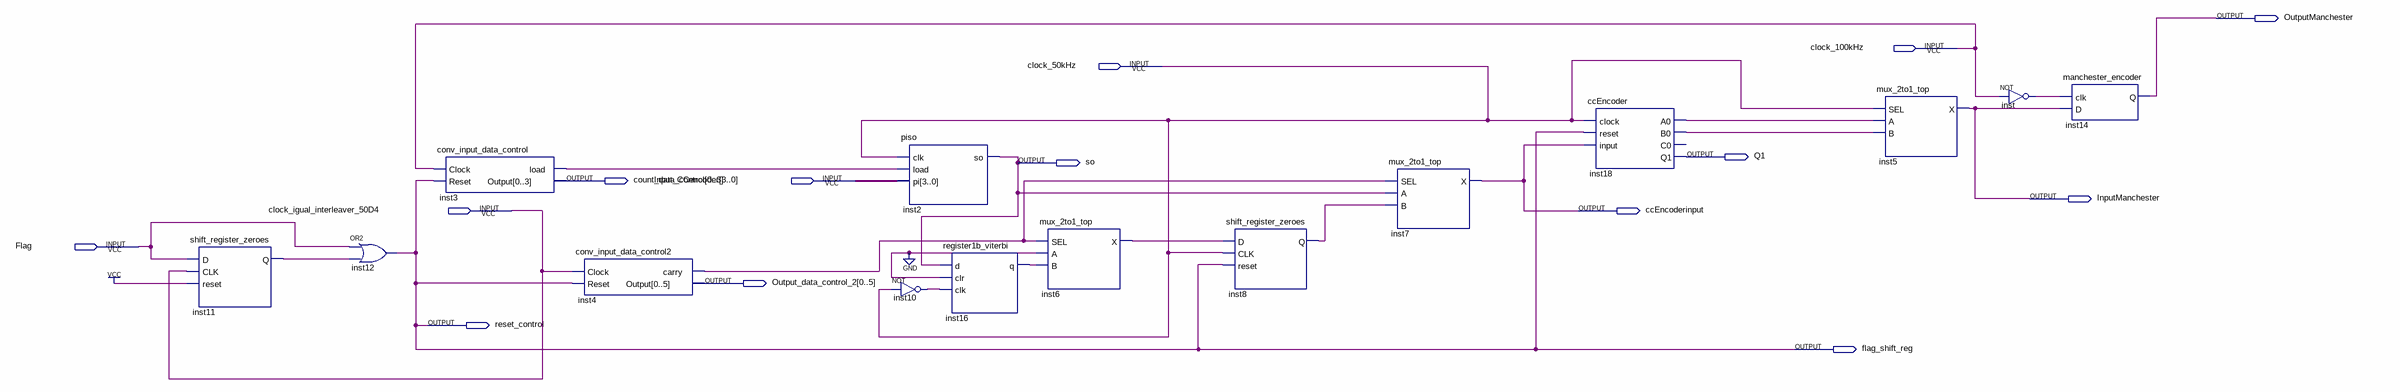
[diagram p0: schematic sheet]
// Quartus schematic encCCencoder.bdf as structural Verilog: 14 symbols, 14 pins
module encCCencoder (
  input  clock_100kHz,
  input  clock_50kHz,
  input  [3:0] Input_CCencoder,
  input  clock_igual_interleaver_50D4,
  input  Flag,
  output OutputManchester,
  output Q1,
  output so,
  output [0:3] count_data_control,
  output InputManchester,
  output ccEncoderinput,
  output [0:5] Output_data_control_2,
  output reset_control,
  output flag_shift_reg
);

  wire inst3_load, inst4_carry, inst6_x, inst8_q, inst10_out, inst11_q, inst16_q, inst18_a0, inst18_b0,
       inst_out;

  shift_register_zeroes inst11 (.D(Flag), .CLK(clock_igual_interleaver_50D4), .reset(1'b1), .Q(inst11_q));
  or inst12 (flag_shift_reg, Flag, inst11_q);
  conv_input_data_control inst3 (
    .Clock(clock_100kHz), .Reset(flag_shift_reg), .load(inst3_load), .Output(count_data_control));
  conv_input_data_control2 inst4 (
    .Clock(clock_igual_interleaver_50D4), .Reset(flag_shift_reg), .carry(inst4_carry),
    .Output(Output_data_control_2));
  piso inst2 (.clk(clock_50kHz), .load(inst3_load), .pi(Input_CCencoder), .so(so));
  not inst10 (inst10_out, clock_50kHz);
  register1b_viterbi inst16 (.d(so), .clr(1'b0), .clk(inst10_out), .q(inst16_q));
  mux_2to1_top inst6 (.SEL(inst4_carry), .A(1'b0), .B(inst16_q), .X(inst6_x));
  shift_register_zeroes inst8 (.D(inst6_x), .CLK(clock_50kHz), .reset(flag_shift_reg), .Q(inst8_q));
  mux_2to1_top inst7 (.SEL(inst4_carry), .A(so), .B(inst8_q), .X(ccEncoderinput));
  ccEncoder inst18 (
    .clock(clock_50kHz), .reset(flag_shift_reg), .\input (ccEncoderinput), .A0(inst18_a0), .B0(inst18_b0),
    .Q1(Q1));  // open: C0
  mux_2to1_top inst5 (.SEL(clock_50kHz), .A(inst18_a0), .B(inst18_b0), .X(InputManchester));
  not inst (inst_out, clock_100kHz);
  manchester_encoder inst14 (.clk(inst_out), .D(InputManchester), .Q(OutputManchester));

  assign reset_control = flag_shift_reg;
endmodule
